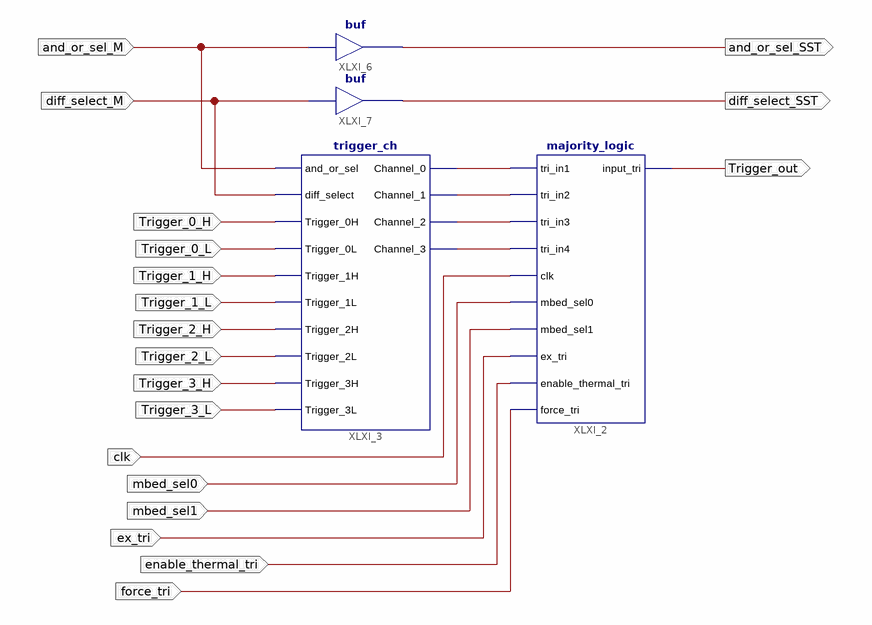
[diagram p0: schematic sheet 1]
// Xilinx ISE schematic majority_sys.sch (spartan3a) as structural Verilog: 4 symbols, 19 ports
module majority_sys (
  input  and_or_sel_M,
  input  diff_select_M,
  input  Trigger_0_H,
  input  Trigger_0_L,
  input  Trigger_1_H,
  input  Trigger_1_L,
  input  Trigger_2_H,
  input  Trigger_2_L,
  input  Trigger_3_H,
  input  Trigger_3_L,
  input  clk,
  input  mbed_sel0,
  input  mbed_sel1,
  input  ex_tri,
  input  enable_thermal_tri,
  input  force_tri,
  output Trigger_out,
  output and_or_sel_SST,
  output diff_select_SST
);

  wire XLXN_18, XLXN_19, XLXN_20, XLXN_21;

  trigger_ch XLXI_3 (
    .Trigger_1L(Trigger_1_L), .Trigger_0H(Trigger_0_H), .Trigger_0L(Trigger_0_L), .Trigger_2H(Trigger_2_H),
    .Trigger_2L(Trigger_2_L), .Trigger_3H(Trigger_3_H), .Trigger_3L(Trigger_3_L), .and_or_sel(and_or_sel_M),
    .diff_select(diff_select_M), .Trigger_1H(Trigger_1_H), .Channel_0(XLXN_21), .Channel_1(XLXN_20),
    .Channel_2(XLXN_19), .Channel_3(XLXN_18));
  majority_logic XLXI_2 (
    .tri_in1(XLXN_21), .tri_in2(XLXN_20), .tri_in3(XLXN_19), .tri_in4(XLXN_18), .clk(clk),
    .mbed_sel0(mbed_sel0), .mbed_sel1(mbed_sel1), .enable_thermal_tri(enable_thermal_tri), .ex_tri(ex_tri),
    .force_tri(force_tri), .input_tri(Trigger_out));
  buf XLXI_6 (and_or_sel_SST, and_or_sel_M);
  buf XLXI_7 (diff_select_SST, diff_select_M);
endmodule
